# EAGLE design CAN_FB_V02_upd (EAGLE 4.09)
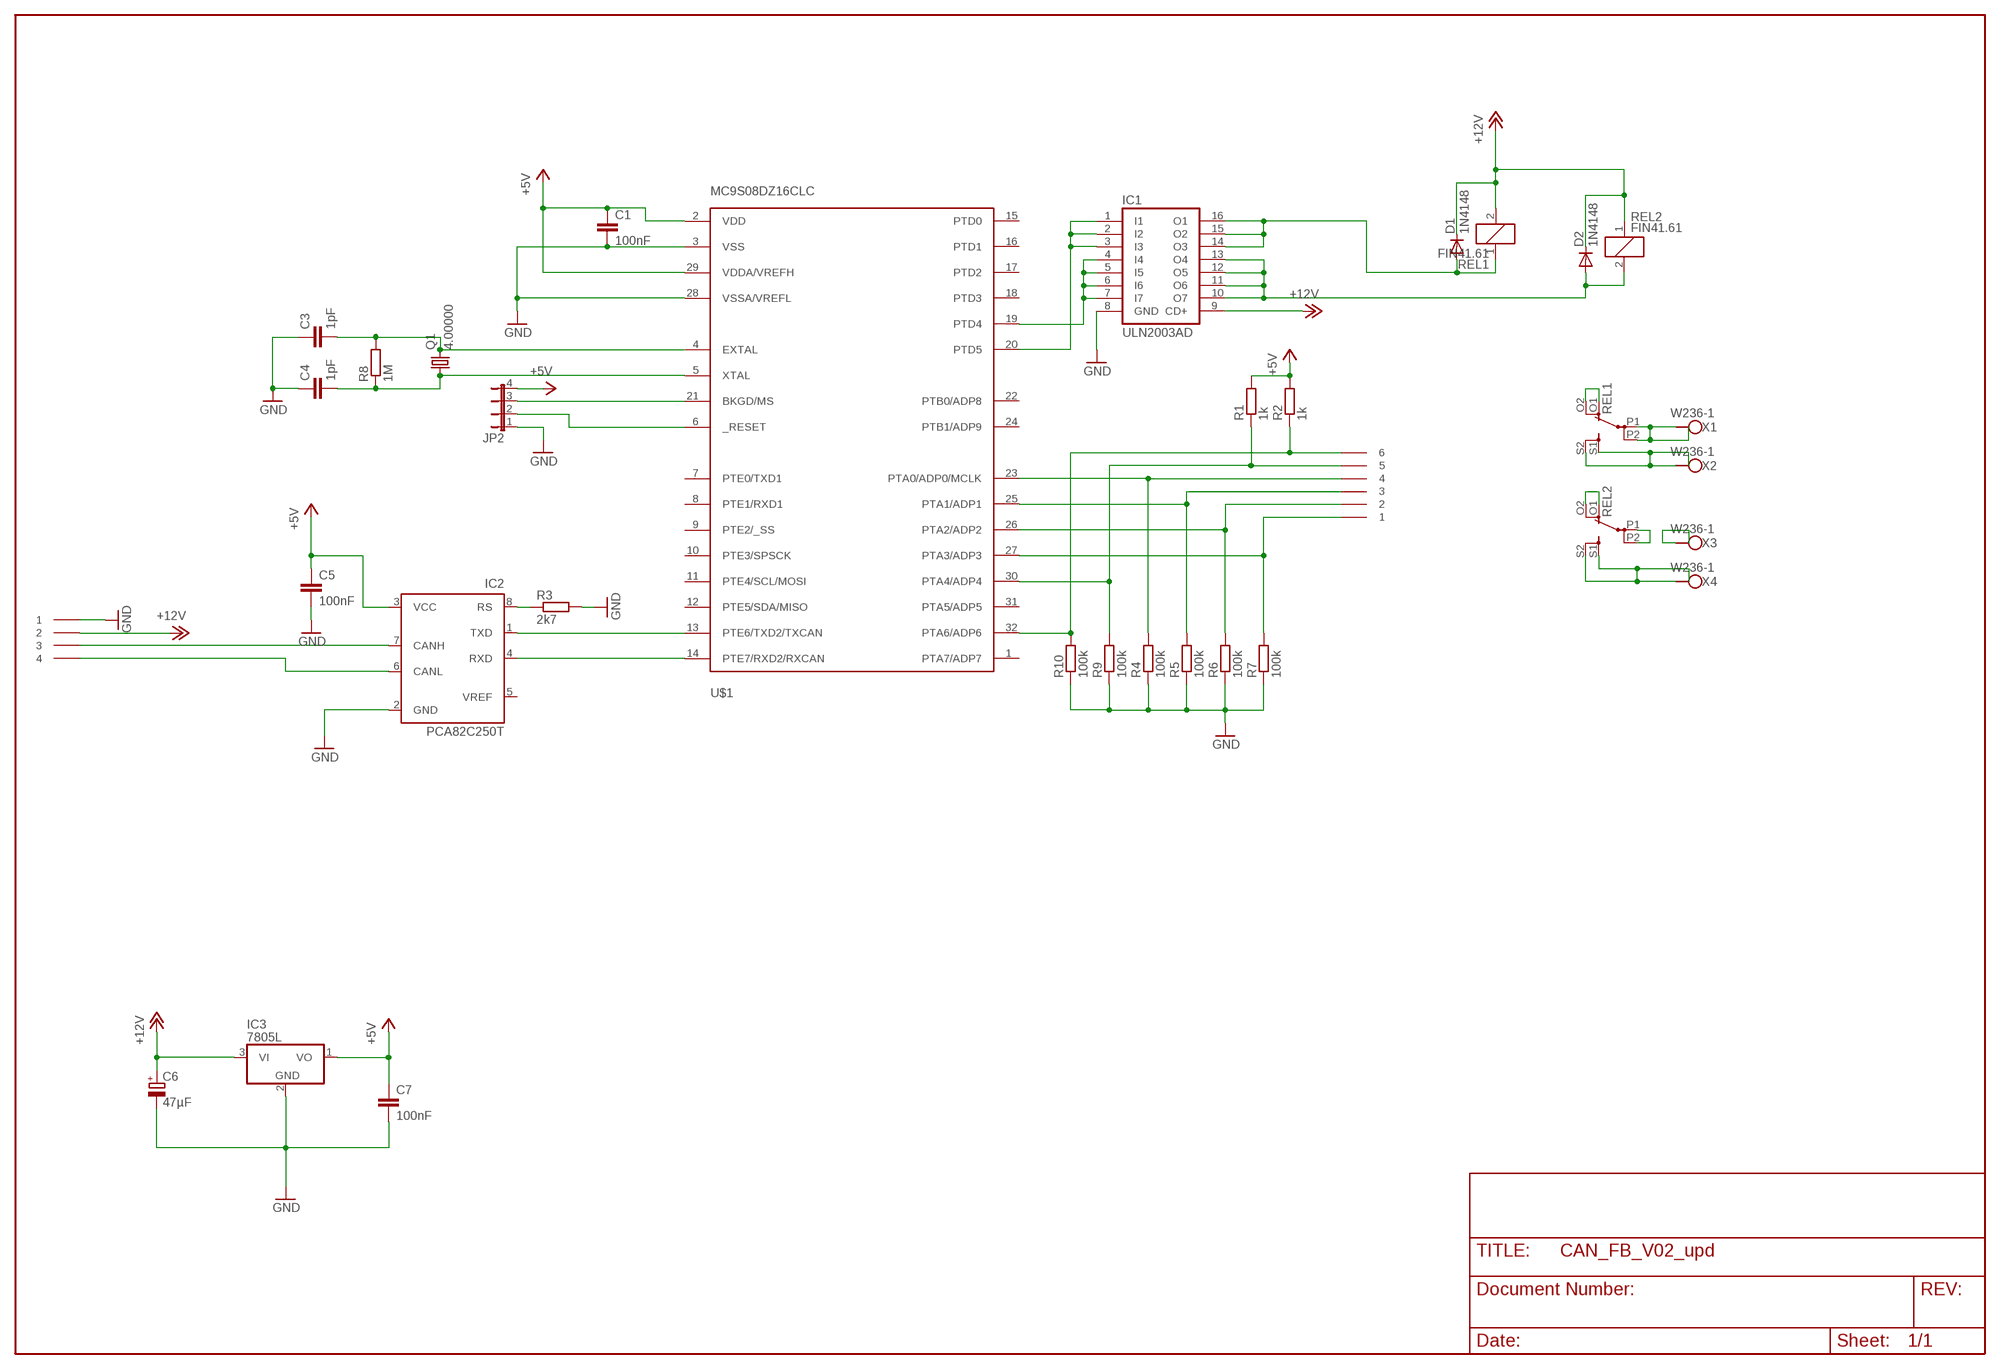
[diagram p0: schematic, sheet 1]

## Parts
C1  100nF  C-EUC0805K  [C0805K]
C3  1pF  C-EUC0805K  [C0805K]
C4  1pF  C-EUC0805K  [C0805K]
C5  100nF  C-EUC0805  [C0805]
C6  47µF  CPOL-EUE2-5  [E2-5]
C7  100nF  C-EUC0805K  [C0805K]
D1  1N4148  DIODE-SOD80C  [SOD80C]
D2  1N4148  DIODE-SOD80C  [SOD80C]
IC1  ULN2003AD  [SO16]
IC2  PCA82C250T  [SO8]
IC3  7805L  [TO92]
JP2  JP4E  [JP4]
KL1  AST021-04  [AST021-04]
KL2  AST021-06  [AST021-06]
Q1  4.00000  CRYTALHC49U-V  [HC49U-V]
R1  1k  R-EU_R0805  [R0805]
R2  1k  R-EU_R0805  [R0805]
R3  2k7  R-EU_R0805  [R0805]
R4  100k  R-EU_R0805  [R0805]
R5  100k  R-EU_R0805  [R0805]
R6  100k  R-EU_R0805  [R0805]
R7  100k  R-EU_R0805  [R0805]
R8  1M  R-EU_R0805  [R0805]
R9  100k  R-EU_R0805  [R0805]
R10  100k  R-EU_R0805  [R0805]
REL1  FIN41.61  [FIN41]
REL2  FIN41.61  [FIN41]
U$1  MC9S08DZ16CLC  [LQFP32]
X1  W236-1  [W236-1]
X2  W236-1  [W236-1]
X3  W236-1  [W236-1]
X4  W236-1  [W236-1]

## Nets
+5V: C1.1 C5.1 C7.1 IC2.3(VCC) IC3.1(VO) JP2.4 R1.2 R2.2 U$1.2(VDD) U$1.29(VDDA/VREFH)
+12V: C6.+ D1.C D2.C IC1.9(CD+) IC3.3(VI) KL1.P$2 REL1.2 REL2.1
A0: KL2.P$4 R4.2 U$1.23(PTA0/ADP0/MCLK)
A1: KL2.P$3 R5.2 U$1.25(PTA1/ADP1)
A2: KL2.P$2 R6.2 U$1.26(PTA2/ADP2)
A3: KL2.P$1 R7.2 U$1.27(PTA3/ADP3)
A4: KL2.P$5 R1.1 R9.2 U$1.30(PTA4/ADP4)
A5: KL2.P$6 R2.1 R10.2 U$1.32(PTA6/ADP6)
GND: C1.2 C3.1 C4.1 C5.2 C6.- C7.2 IC1.8(GND) IC2.2(GND) IC3.2(GND) JP2.1 KL1.P$1 R3.2 R4.1 R5.1 R6.1 R7.1 R9.1 R10.1 U$1.3(VSS) U$1.28(VSSA/VREFL)
N$1: IC2.1(TXD) U$1.13(PTE6/TXD2/TXCAN)
N$2: IC2.4(RXD) U$1.14(PTE7/RXD2/RXCAN)
N$3: IC2.8(RS) R3.1
N$4: IC2.6(CANL) KL1.P$4
N$6: D1.A IC1.14(O3) IC1.15(O2) IC1.16(O1) REL1.1
N$7: IC2.7(CANH) KL1.P$3
N$8: D2.A IC1.10(O7) IC1.11(O6) IC1.12(O5) IC1.13(O4) REL2.2
N$9: C4.2 Q1.1 R8.1 U$1.5(XTAL)
N$10: C3.2 Q1.2 R8.2 U$1.4(EXTAL)
N$11: IC1.1(I1) IC1.2(I2) IC1.3(I3) U$1.20(PTD5)
N$12: IC1.4(I4) IC1.5(I5) IC1.6(I6) IC1.7(I7) U$1.19(PTD4)
N$16: REL1.S1(S) REL1.S2(S) X2.1(KL1) X2.2(KL2)
N$18: REL1.P1(P) REL1.P2(P) X1.1(KL1) X1.2(KL2)
N$20: REL1.O1(O) REL1.O2(O)
N$21: JP2.2 U$1.6(_RESET)
N$22: JP2.3 U$1.21(BKGD/MS)
N$23: REL2.O1(O) REL2.O2(O)
N$25: X3.1(KL1) X3.2(KL2)
N$26: REL2.S1(S) REL2.S2(S) X4.1(KL1) X4.2(KL2)
N$27: REL2.P1(P) REL2.P2(P)
Unconnected: IC2.5(VREF) U$1.1(PTA7/ADP7) U$1.7(PTE0/TXD1) U$1.8(PTE1/RXD1) U$1.9(PTE2/_SS) U$1.10(PTE3/SPSCK) U$1.11(PTE4/SCL/MOSI) U$1.12(PTE5/SDA/MISO) U$1.15(PTD0) U$1.16(PTD1) U$1.17(PTD2) U$1.18(PTD3) U$1.22(PTB0/ADP8) U$1.24(PTB1/ADP9) U$1.31(PTA5/ADP5)

## Library data of the parts
C1 C3-C5 C7 = rcl:C-EU: CAPACITOR, European symbol
C6 = rcl:CPOL-EU: POLARIZED CAPACITOR, European symbol
D1 D2 = diode:DIODE-: DIODE
IC1 = uln-udn:ULN2003A: DRIVER ARRAY
IC2 = micro-philips:PCA82C250: CAN CONTROLLER INTERFACE
IC3 = linear:78*: Positive VOLTAGE REGULATOR
JP2 = jumper:JP4E: JUMPER
KL1 = con-ria:AST021-04
KL2 = con-ria:AST021-06
Q1 = crystal:CRYTAL: CRYSTAL
R1-R10 = rcl:R-EU_: RESISTOR, European symbol
REL1 REL2 = relay:FIN41.61
U$1 = MC9S08DZ16CLC:MC9S08DZ16CLC
X1-X4 = con-wago-508:W236-1: WAGO SREW CLAMP

## Board
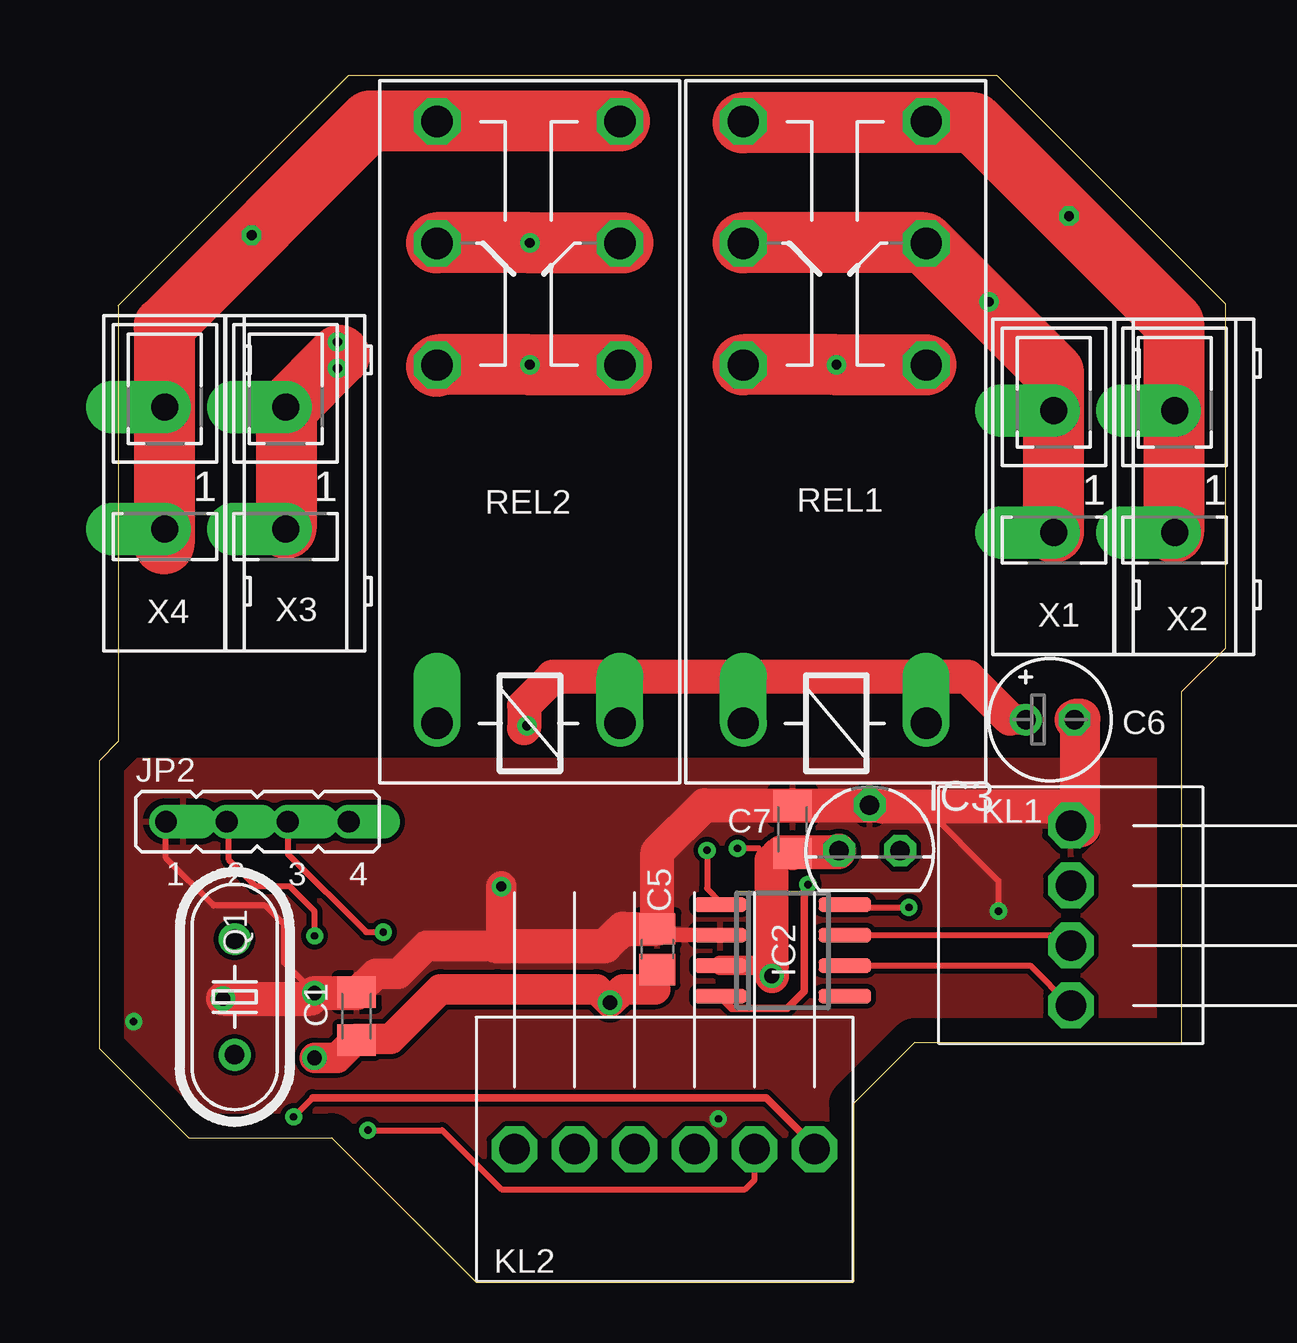
[diagram p1: board, top side]
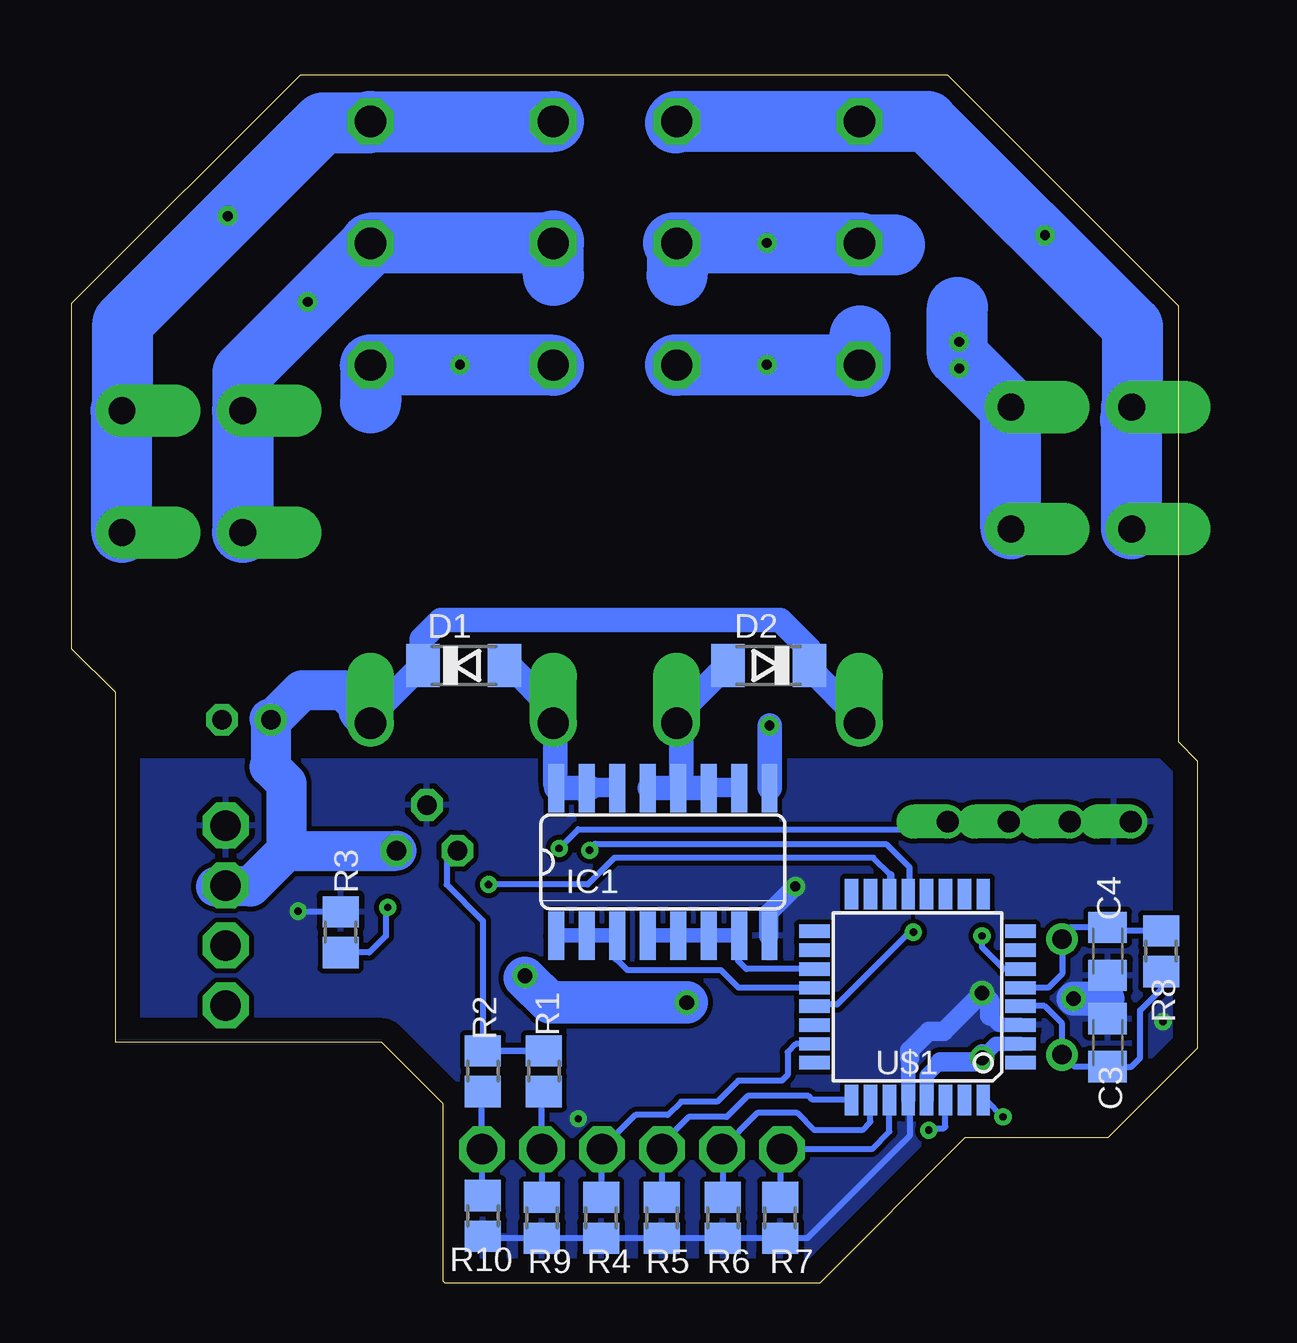
[diagram p2: board, bottom side, seen from below]

Size 46.91 x 50.32 mm. Coordinates in mm from the lower left corner, seen from the top.
Outline: 0.79,40.72 0.79,22.54 0,21.75 0,9.76 3.73,6.03 9.68,6.03 15.72,0 31.35,0 31.43,0.08 31.43,7.46 33.97,10 45.08,10 45.08,24.61 46.91,26.43 46.91,40.8 37.39,50.32 10.4,50.32 0.79,40.72
Copper layers used: Top, Bottom

### Footprints (pad centres in the part's own frame; a part is rotated, then mirrored left to right if it is on the bottom)
C0805K = smd 1.3 x 1.6: 1 -1,0; 2 1,0
C0805 = smd 1.3 x 1.5: 1 -0.85,0; 2 0.85,0
E2-5 = drill 0.813 pad 1.27 round: + -1.016,0 | drill 0.813 pad 1.27 octagon: - 1.016,0
SOD80C = smd 1.4 x 1.8: A 1.7,0; C -1.7,0
SO16 = smd 0.66 x 2.032: 1 -4.445,-3.073; 2 -3.175,-3.073; 3 -1.905,-3.073; 4 -0.635,-3.073; 5 0.635,-3.073; 6 1.905,-3.073; 7 3.175,-3.073; 8 4.445,-3.073; 9 4.445,3.073; 10 3.175,3.073; 11 1.905,3.073; 12 0.635,3.073; 13 -0.635,3.073; 14 -1.905,3.073; 15 -3.175,3.073; 16 -4.445,3.073
SO8 = smd 0.6 x 2.2: 1 -1.905,-2.6; 2 -0.635,-2.6; 3 0.635,-2.6; 4 1.905,-2.6; 5 1.905,2.6; 6 0.635,2.6; 7 -0.635,2.6; 8 -1.905,2.6
TO92 = drill 0.813 octagon: 1 -1.27,0; 2 0,1.905; 3 1.27,0
JP4 = drill 0.914 offset: 1 -3.81,0; 2 -1.27,0; 3 1.27,0; 4 3.81,0
AST021-04 = drill 1.27 octagon: P$1 0,0; P$2 0,2.5; P$3 0,5; P$4 0,7.5
AST021-06 = drill 1.27 octagon: P$1 0,0; P$2 0,2.5; P$3 0,5; P$4 0,7.5; P$5 0,10; P$6 0,12.5
HC49U-V = drill 0.813 round: 1 -2.413,0; 2 2.413,0
R0805 = smd 1.3 x 1.5: 1 -0.85,0; 2 0.85,0
FIN41 = drill 1.3 offset: 1 -10.16,3.81; 2 -10.16,-3.81 | drill 1.3 octagon: O1 4.763,-3.81; O2 4.763,3.81; P1 9.842,-3.81; P2 9.842,3.81; S1 14.922,-3.81; S2 14.922,3.81
LQFP32 = smd 1.27 x 0.559: 1 -4.293,2.743; 2 -4.293,1.956; 3 -4.293,1.168; 4 -4.293,0.381; 5 -4.293,-0.381; 6 -4.293,-1.168; 7 -4.293,-1.956; 8 -4.293,-2.743; 17 4.293,-2.743; 18 4.293,-1.956; 19 4.293,-1.168; 20 4.293,-0.381; 21 4.293,0.381; 22 4.293,1.168; 23 4.293,1.956; 24 4.293,2.743 | smd 0.559 x 1.27: 9 -2.743,-4.293; 10 -1.956,-4.293; 11 -1.168,-4.293; 12 -0.381,-4.293; 13 0.381,-4.293; 14 1.168,-4.293; 15 1.956,-4.293; 16 2.743,-4.293; 25 2.743,4.293; 26 1.956,4.293; 27 1.168,4.293; 28 0.381,4.293; 29 -0.381,4.293; 30 -1.168,4.293; 31 -1.956,4.293; 32 -2.743,4.293
W236-1 = drill 1.118 pad 2.184 offset: 1 0,-2.54; 2 0,2.54

### Placement (x,y rotation side)
C1  10.72,11.11 90 top
C3  10pF  [C0805K]  3.74,10 270 bottom
C4  10pF  [C0805K]  3.74,13.81 90 bottom
C5  23.26,13.89 90 top
C6  39.62,23.46 0 top
C7  28.89,18.89 90 top
D1  30.56,25.72 0 bottom
D2  17.86,25.72 180 bottom
IC1  22.27,17.53 0 bottom
IC2  28.47,13.85 270 top
IC3  32.1,18 0 top
JP2  6.59,19.21 0 top
KL1  40.48,19.05 180 top
KL2  17.3,5.56 270 top
Q1  5.64,11.9 270 top
R1  27.23,8.81 90 bottom
R2  29.77,8.81 90 bottom
R3  35.69,14.6 90 bottom
R4  24.84,2.7 90 bottom
R5  22.3,2.7 90 bottom
R6  19.76,2.7 90 bottom
R7  17.38,2.7 90 bottom
R8  1.51,13.81 270 bottom
R9  27.3,2.7 90 bottom
R10  29.77,2.78 90 bottom
REL1  30.64,33.47 90 top
REL2  17.88,33.47 90 top
U$1  11.66,11.9 180 bottom
X1  39.77,33.8 180 top
X2  44.81,33.8 180 top
X3  7.76,33.95 180 top
X4  2.73,33.95 180 top

### Tracks (layer width: path | path; a pad name or v marks a point on that pad's centre or on a via)
+5V  (via drill 0.3, 0.61)
  Top 0.254: v26.59,18.1 27.46,18.1 27.94,17.62
  Top 0.305: v28.02,12.78 28.02,12.7 | C5.1 23.26,13.02 23.15,12.91 23.15,12.22
  Top 0.813: 28.02,13.21 IC2.3
  Top 1.27: 10.72,10.16 9.92,9.37 v8.97,9.37 | 10.72,10.16 C1.1 | 10.72,10.16 12.14,10.16 14.21,12.22 16.59,12.22 20.72,12.22 v21.27,11.67 21.83,12.22 23.15,12.22 | v28.02,12.78 28.02,12.7 | 28.02,17.54 27.94,17.62
  Top 1.422: v28.02,12.78 28.02,13.21 28.02,17.54 28.42,17.94 28.89,17.94 | v28.02,12.78 | 28.89,17.94 C7.1 | IC3.1 30.83,17.97 30.8,17.94 28.89,17.94
  Bottom 0.254: 29.77,9.68 | 29.77,9.68 R2.2 | 29.77,9.68 29.74,9.66 R1.2 R2.2 | R2.2 29.77,15.08 31.27,16.59 31.27,17.94 31.31,17.97 IC3.1 | JP2.4 | JP2.4 10.72,18.89 25.8,18.89 v26.59,18.1
  Bottom 0.305: v28.02,12.78 | 28.02,12.7 v28.02,12.78
  Bottom 0.61: U$1.2 8.39,9.95 v8.97,9.37 | U$1.29 11.28,8.64 10.72,9.21
  Bottom 0.813: 10.72,9.21 9.29,9.21 8.97,9.52 v8.97,9.37
  Bottom 1.27: v28.02,12.78 28.1,12.78
  Bottom 1.778: v21.27,11.67 26.99,11.67 28.02,12.7
+12V  (via drill 0.41)
  Top 0.254: v17.82,23.21 17.7,23.1
  Top 1.27: C6.+ 37.97,23.46 37.94,23.49
  Top 1.422: 17.7,23.1 17.7,24.05 18.89,25.24 36.19,25.24 37.94,23.49
  Bottom 0.254: 40.88,16.51 KL1.P$2
  Bottom 0.61: 16.16,25.6 16.23,25.6 | 14.05,23.18 14.07,23.2 REL2.1
  Bottom 1.016: REL1.2 34.45,23.57 32.31,25.72 | 32.31,25.72 D1.C | 32.31,25.72 32.31,26.83 31.51,27.62 17.38,27.62 16.16,26.4 D2.C 16.16,25.6 14.07,23.52 REL2.1 | v17.82,23.21 IC1.9
  Bottom 1.676: 34.95,23.81 34.69,23.81 34.45,23.57 | REL1.2 34.95,23.81 | 37.96,18 IC3.3 | 37.96,18 39.45,16.51 40.88,16.51 | 37.96,18 37.96,20.81 38.66,21.51 38.6,21.56 C6.+ 38.62,23.46 | 34.95,23.81 34.95,24.08 35.56,24.69 37.31,24.69 38.58,23.42 38.62,23.46 | 38.62,23.46 38.66,23.49
A0
  Bottom 0.254: 24.84,5.56 23.42,6.98 22.07,6.98 21.51,7.54 20,7.54 19.13,8.41 17.3,8.41 17.07,8.65 17.07,9.6 16.72,9.95 U$1.23 | 24.84,5.56 R4.2
  Bottom 0.305: KL2.P$4 24.84,5.56
A1
  Bottom 0.254: U$1.25 14.4,7.11 | 14.53,7.62 16.03,7.62 16.19,7.78 18.73,7.78 19.61,6.91 21.19,6.91 22.38,5.71 | KL2.P$3 R5.2
  Bottom 0.305: 14.4,7.11 14.4,7.5 14.53,7.62 | KL2.P$3 22.3,5.63 22.38,5.71 | KL2.P$3
A2
  Bottom 0.254: R6.2 19.76,5.48 19.84,5.56 18.34,7.06 16.67,7.06 15.95,6.35 13.97,6.35 13.62,6.7 U$1.26
  Bottom 0.305: 19.84,5.56 KL2.P$2
A3
  Bottom 0.254: U$1.27 12.83,6.3 13.57,5.56 KL2.P$1 | 17.38,5.4 R7.2
  Bottom 0.305: 17.3,5.48 | KL2.P$1 17.3,5.48 | 17.3,5.48 17.38,5.4
A4  (via drill 0.3)
  Top 0.254: v11.19,6.35 14.29,6.35 16.75,3.89 26.91,3.89 27.3,4.29 KL2.P$5
  Bottom 0.254: U$1.30 10.49,6.49 10.56,6.43 11.11,6.43 v11.19,6.35 | R1.1 27.3,7.88 KL2.P$5 R9.2
A5  (via drill 0.3)
  Top 0.254: v8.1,6.91 8.89,7.7
  Top 0.305: 8.89,7.7 27.78,7.7 29.8,5.68 KL2.P$6
  Bottom 0.254: 29.77,8.02 | 29.77,8.02 R2.1 29.77,7.94 | 29.77,8.02 29.8,7.98 KL2.P$6 29.8,3.57 29.77,3.57 R10.2 | U$1.32 8.8,7.61 v8.1,6.91 | 29.77,7.94 | 29.77,7.94 30.32,7.94
GND  (via drill 0.3, 0.41, 0.61)
  Top 0.254: v8.97,12.06 7.7,13.33 7.7,14.92 6.91,15.72 4.76,15.72 2.78,17.7 JP2.1 | 32.62,19.84 32.54,19.92 34.29,19.92 37.46,16.75 v37.46,15.48
  Top 0.305: 23.2,14.74 23.18,14.76 | C5.2 23.2,14.74 | 23.3,14.48 23.3,14.64 23.2,14.74
  Top 0.406: 8.81,11.83 8.97,11.99 v8.97,12.06
  Top 0.61: 23.3,14.48 IC2.2
  Top 0.813: 10.72,12.06 10.72,12.07 C1.2
  Top 1.27: v16.75,16.51 16.75,14.29 16.53,14.07 16.53,14.03 13.63,14.03 12.46,12.86 11.51,12.86 10.76,12.11 C1.2
  Top 1.422: v8.97,12.06 10.72,12.06 | 32.58,19.89 IC3.2 | 32.58,19.89 C7.2 25.21,19.89 23.26,17.94 C5.2 21.8,14.74 21.09,14.03 16.53,14.03 | 32.58,19.89 32.62,19.84 40,19.84 40.88,18.97 | v5.16,11.83 8.81,11.83
  Top 1.676: C6.- 40.69,23.46 40.72,23.49 40.88,23.49 40.88,18.97 KL1.P$1
  Bottom 0.254: 24.84,1.9 | 24.84,1.9 R4.1 27.28,1.85 27.3,1.83 R9.1 29.71,1.85 29.77,1.9 R10.1 | 24.84,1.9 24.79,1.85 R5.1 22.3,1.9 22.25,1.85 R6.1 19.76,1.9 19.71,1.85 R7.1 16.25,1.85 11.99,6.11 11.99,7.54 | R3.2 35.72,15.48 v37.46,15.48
  Bottom 0.305: U$1.28 12.06,7.62 | U$1.28 | U$1.28 11.99,7.54
  Bottom 0.406: C3.1 3.74,11.83
  Bottom 0.61: IC1.8 17.84,14.46 17.86,14.45 | U$1.3 8.27,10.73 8.65,11.11 | U$1.28 12.04,9.31 11.99,9.37
  Bottom 0.813: 3.73,12.7 3.74,12.69 C3.1 3.74,12.85 | 3.74,12.85 C4.1 | 3.74,12.85 3.73,12.86 | 8.65,11.11 8.65,11.75 v8.97,12.06 10.56,10.48 11.19,10.48 11.99,9.68 11.99,9.37 | 17.86,14.45 17.86,15.4 v16.75,16.51
  Bottom 1.422: 3.74,11.83 v5.16,11.83
  other vias: 1.43,10.87 25.8,6.83
  pour Bottom: -0.24,21.75 -0.24,10.08 3.81,6.03 9.13,6.03 9.13,6.03 9.68,6.03 15.64,0.08 31.35,0.08 31.43,0.16 31.43,7.06 34.45,10.08 45.24,10.08 45.24,21.75
  pour Top: -0.24,21.83 -0.24,10.08 3.81,6.03 9.68,6.03 15.64,0.08 31.43,0.08 31.43,7.06 34.45,10.08 45.16,10.08 45.24,10.08 45.24,21.75 -0.08,21.75
N$1  (via drill 0.3)
  Top 0.254: IC2.1 25.87,15.78 25.88,15.8 25.88,15.87 25.32,16.43 v25.32,18.02
  Bottom 0.254: 12.14,16.19 | U$1.13 12.14,16.19 | 12.14,16.19 11.99,16.35 11.99,16.19 | 11.99,16.19 | 11.99,16.19 11.99,17.3 12.94,18.26 25.08,18.26
  Bottom 0.305: 25.08,18.26 v25.32,18.02
N$2  (via drill 0.3)
  Top 0.305: v29.53,16.59 29.37,16.43 29.37,12.14 28.65,11.43 26.35,11.43 25.87,11.92 IC2.4
  Bottom 0.254: v29.53,16.59 25.4,16.59 24.29,17.7 13.49,17.7 12.78,16.99
  Bottom 0.305: 12.86,16.19 | U$1.14 12.86,16.19 | 12.78,16.99 12.78,16.27 12.86,16.19
N$3  (via drill 0.3)
  Top 0.254: 31.11,15.64 v33.73,15.64
  Top 0.305: IC2.8 31.04,15.72 31.11,15.64
  Bottom 0.254: R3.1 34.51,13.75 33.81,14.45 33.81,15.56
  Bottom 0.305: v33.73,15.64 33.81,15.56
N$4
  Top 0.254: IC2.6 38.78,13.21 40.48,11.51
  Top 0.305: 40.48,11.51 KL1.P$4
N$6
  Bottom 0.254: IC1.14 24.34,20.61 24.37,20.64
  Bottom 0.813: 25.29,20.61 25.32,20.64 24.37,20.64 | 25.29,20.61
  Bottom 1.016: IC1.15 25.35,20.61 25.32,20.64 25.29,20.61 | IC1.15 25.44,20.52 25.48,20.48 25.61,20.61 IC1.16 | IC1.15 26.56,20.61 26.75,20.8 26.75,23.34 26.77,23.31 REL1.1 26.83,23.89 28.65,25.72 D1.A
N$7
  Top 0.254: IC2.7 40.05,14.48 KL1.P$3
  Top 0.305: KL1.P$3
N$8
  Bottom 0.254: IC1.13 22.89,20.61 22.86,20.64 22.83,20.61 22.81,20.61
  Bottom 0.305: IC1.10 19.26,20.61 19.29,20.64
  Bottom 0.813: IC1.11 20.4,20.56 | IC1.11 | 19.29,20.64 20.32,20.64 IC1.11
  Bottom 1.016: IC1.11 20.53,20.61 20.56,20.64 | IC1.11 21.48,20.61 21.51,20.64 21.54,20.61 IC1.12 22.75,20.61 22.78,20.64 22.81,20.61 | IC1.11 21.32,20.61 21.51,20.8 21.51,23.18 21.67,23.34 REL2.2 21.69,23.63 19.61,25.72 D2.A
N$9
  Bottom 0.254: U$1.5 6.21,12.28 5.64,12.86 5.64,14.29 Q1.1 5.64,14.44 5.27,14.81 C4.2 3.74,14.77 3.63,14.66 R8.1
N$10
  Bottom 0.254: U$1.4 6.36,11.52 5.64,10.79 5.64,9.52 | 5.64,9.52 Q1.2 | 5.64,9.52 5.11,9 C3.2 2.75,9 2.38,9.37 2.38,11.35 1.51,12.22 1.51,12.78 1.43,12.86 1.51,12.94 R8.2
N$11
  Bottom 0.254: 24.21,14.6 24.17,14.57 IC1.3 | U$1.20 19.11,12.28 19.84,13.02 23.73,13.02 24.21,13.49
  Bottom 0.305: IC1.3 24.19,14.46 24.21,14.45 24.21,13.49
  Bottom 0.61: IC1.3 IC1.2 | IC1.2 25.46,14.46 25.48,14.45 | 26.73,14.46 IC1.1 | IC1.2 26.73,14.46 | 26.73,14.46 26.75,14.45
N$12
  Bottom 0.254: IC1.7 19.09,14.32 19.13,14.29 19.13,13.41 18.79,13.07 U$1.19
  Bottom 0.61: IC1.7 IC1.6 | IC1.6 20.38,14.46 20.4,14.45 | IC1.6 21.5,14.46 21.51,14.45 21.52,14.46 IC1.5 22.77,14.46 22.78,14.45 22.79,14.46 IC1.4
N$16  (via drill 0.41)
  Top 0.406: 36.43,48.34 36.51,48.34 v40.4,44.45 44.77,40.08 44.77,40
  Top 2.54: 44.77,31.27 44.77,40 36.43,48.34 26.83,48.34
  Bottom 0.406: v40.4,44.45 40.4,44.37 44.77,40
  Bottom 2.54: 34.47,48.39 REL1.S1 | 34.47,48.39 REL1.S2 | 34.47,48.39 34.53,48.34 36.43,48.34 44.77,40 44.77,36.43 44.85,36.35 44.84,36.34 X2.1 44.78,36.34 | 44.78,36.34 44.77,36.35 | X2.2 44.81,36.31 44.78,36.34
N$18  (via drill 0.41)
  Top 0.254: v37.07,40.88 39.77,38.18 X1.2
  Top 2.54: 26.83,43.34 34.37,43.34 39.77,37.94 X1.2
  Bottom 0.254: X1.2 39.77,38.17 v37.07,40.88
  Bottom 2.54: 39.77,37.94 X1.1 X1.2 39.77,37.94 | 39.77,37.94 34.45,43.26 REL1.P1 34.39,43.31 34.37,43.34 34.35,43.31 REL1.P2 26.83,43.42 26.83,41.99
N$20  (via drill 0.41)
  Top 0.406: REL1.O2 26.83,38.26 v30.72,38.26
  Top 2.54: 26.83,38.26 v30.72,38.26 34.45,38.26
  Bottom 0.406: v30.72,38.26 26.75,38.26
  Bottom 2.54: REL1.O2 34.39,38.23 34.45,38.18 REL1.O1 34.45,38.26 34.45,36.67
N$21  (via drill 0.3)
  Top 0.254: v8.97,14.45 8.97,15.48 7.94,16.51 6.51,16.51 5.4,17.62 5.4,19.13
  Top 0.305: JP2.2 | 5.4,19.13 JP2.2
  Bottom 0.254: U$1.6 8.07,13.07 8.97,13.97 v8.97,14.45
N$22  (via drill 0.3)
  Top 0.254: v11.83,14.6 11.11,14.6 7.86,17.86 JP2.3
  Bottom 0.254: U$1.21 15.95,11.43 15.8,11.59 15,11.59 11.99,14.6 v11.83,14.6
N$23  (via drill 0.41)
  Top 2.54: 21.75,38.26 v17.94,38.26 14.13,38.26 14.05,38.18
  Bottom 0.254: 21.72,38.23 17.96,38.23 v17.94,38.26
  Bottom 2.54: 21.72,38.23 REL2.O1 | 21.72,38.23 REL2.O2 14.05,38.18 14.05,39.45 | 21.72,38.23 21.75,38.26
N$25  (via drill 0.41)
  Top 0.254: 9.92,38.66 9.92,38.18 | 10.08,38.66 10,38.66 9.92,38.66 | 9.92,38.66 v9.92,39.21 | 7.78,36.43 8.25,36.43 v9.92,38.1
  Top 2.54: 7.78,31.43 7.78,36.43 10,38.66
  Bottom 0.254: v9.92,38.1 9.45,38.1 7.78,36.43
  Bottom 2.54: 10,40.64 10,38.66 7.78,36.43 7.76,36.42 | 7.76,35.94 7.76,36.42 | X3.2 7.76,35.94 | 7.76,35.94 7.78,35.96 | 7.76,36.42 X3.1
N$26  (via drill 0.41)
  Top 0.406: 2.7,39.85 2.7,40 6.27,43.58 | v6.35,43.66 6.51,43.66 11.27,48.42
  Top 2.54: 21.67,48.42 11.27,48.42 2.7,39.85 2.7,30.8
  Bottom 0.406: 11.25,48.39 11.09,48.39 v6.35,43.66
  Bottom 2.54: REL2.S1 21.75,48.34 | REL2.S1 | REL2.S1 REL2.S2 11.25,48.39 2.7,39.85 2.7,35.96 2.72,35.93 X4.1 2.75,35.93 | 2.75,35.93 2.78,35.96 | X4.2 2.73,35.91 2.75,35.93
N$27  (via drill 0.41)
  Top 0.254: REL2.P2 17.91,43.31 v17.94,43.34
  Top 2.54: 14.05,43.34 v17.94,43.34 21.83,43.34
  Bottom 0.254: v17.94,43.34 14.05,43.34
  Bottom 2.54: REL2.P1 REL2.P2 14.05,43.34 13.97,43.26 12.62,43.26 | REL2.P1 21.8,43.31 21.83,43.34 | 21.67,41.99 21.67,43.34 21.75,43.26 REL2.P1